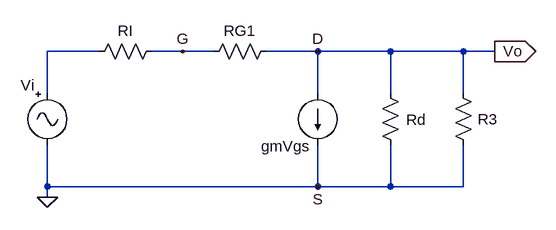
[diagram p0: schematic piccolosegnale2-1.asc]
piccolosegnale2-1.asc, the LTspice schematic file:
Version 4
SHEET 1 880 680
WIRE -144 96 -224 96
WIRE -16 96 -64 96
WIRE 32 96 -16 96
WIRE 192 96 112 96
WIRE 304 96 192 96
WIRE 416 96 304 96
WIRE 464 96 416 96
WIRE -224 160 -224 96
WIRE 192 160 192 96
WIRE 304 160 304 96
WIRE 416 160 416 96
WIRE -224 304 -224 240
WIRE 192 304 192 240
WIRE 192 304 -224 304
WIRE 304 304 304 240
WIRE 304 304 192 304
WIRE 416 304 416 240
WIRE 416 304 304 304
WIRE -224 320 -224 304
FLAG -224 320 0
FLAG 464 96 Vo
IOPIN 464 96 Out
FLAG -16 96 G
FLAG 192 96 D
FLAG 192 304 S
SYMBOL current 192 160 R0
WINDOW 0 -87 82 Left 2
SYMATTR InstName gmVgs
SYMATTR Value ""
SYMBOL res 288 144 R0
WINDOW 0 40 57 Left 2
SYMATTR InstName Rd
SYMATTR Value ""
SYMBOL res 400 144 R0
WINDOW 0 38 56 Left 2
SYMATTR InstName R3
SYMATTR Value ""
SYMBOL res 128 80 R90
WINDOW 0 0 56 VBottom 2
WINDOW 3 32 56 VTop 2
SYMATTR InstName RG1
SYMATTR Value ""
SYMBOL res -48 80 R90
WINDOW 0 0 56 VBottom 2
WINDOW 3 32 56 VTop 2
SYMATTR InstName RI
SYMATTR Value ""
SYMBOL Misc\\signal -224 144 R0
WINDOW 0 -41 4 Left 2
SYMATTR InstName Vi
SYMATTR Value ""

The netlist it stands for:
* piccolosegnale2-1.asc
I§gmVgs D 0
Rd D 0
R3 D 0
RG1 D G
RI G N001
Vi N001 0
.backanno
.end